# EAGLE design MODUL_RS232_V101 (EAGLE 6.4)

## Sheet 1 of 2
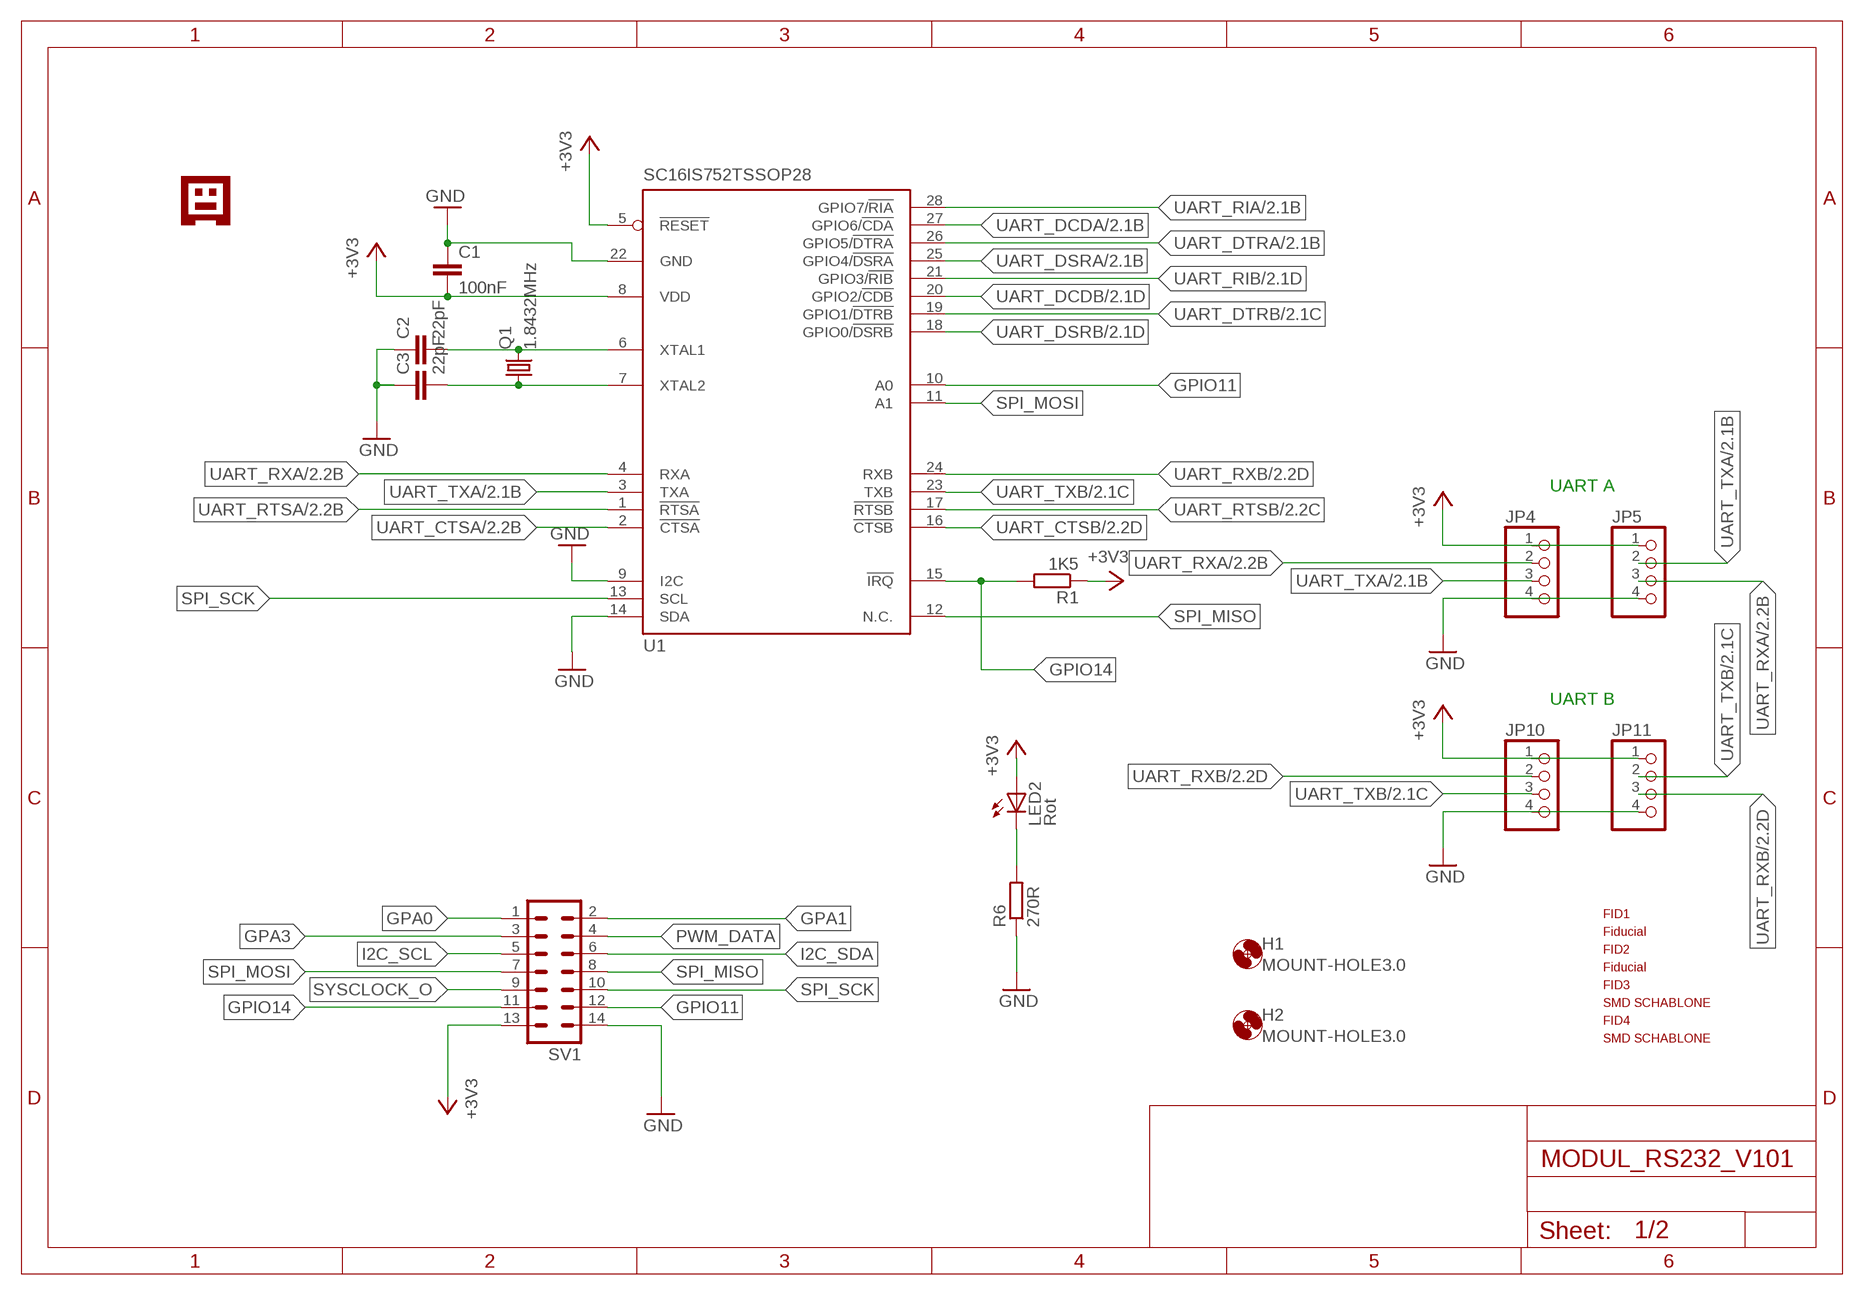
[diagram p0: schematic, sheet 1]

### Parts
C1  100nF  C-EUC0805  [C0805]
C2  22pF  C-EUC0805  [C0805]
C3  22pF  C-EUC0805  [C0805]
FID1  PASSERMARKEN_FIDUCIAL  [PASSERMARKEN_FIDUCIAL]
FID2  PASSERMARKEN_FIDUCIAL  [PASSERMARKEN_FIDUCIAL]
FID3  PASSERMARKEN_FIDUCIAL  [PASSERMARKEN_FIDUCIAL]
FID4  PASSERMARKEN_FIDUCIAL  [PASSERMARKEN_FIDUCIAL]
H1  MOUNT-HOLE3.0  [3,0]
H2  MOUNT-HOLE3.0  [3,0]
JP4  PINHD-1X4  [1X04]
JP5  PINHD-1X4  [1X04]
JP10  PINHD-1X4  [1X04]
JP11  PINHD-1X4  [1X04]
LED2  Rot  LEDCHIP-LED0805  [CHIP-LED0805]
Q1  1.8432MHz  CRYSTALHC49UP  [HC49UP]
R1  1K5  R-EU_R0805  [R0805]
R6  270R  R-EU_R0805  [R0805]
SV1  ML14  [ML14]
U1  SC16IS752TSSOP28  [TSSOP28]
U$2  GNUBLINLOGOSIEB  [GNUSIEBDRUCK]

### Nets
+3V3: C1.2 JP4.1 JP5.1 JP10.1 JP11.1 LED2.A R1.1 SV1.13 U1.5(!RESET) U1.8(VDD) ; also sheet 2
GND: C1.1 C2.1 C3.1 JP4.4 JP5.4 JP10.4 JP11.4 R6.1 SV1.14 U1.9(I2C) U1.14(SDA) U1.22(GND) ; also sheet 2
GPA0: SV1.1
GPA1: SV1.2
GPA3: SV1.3
GPIO11: SV1.12 U1.10(A0)
GPIO14: R1.2 SV1.11 U1.15(!IRQ)
I2C_SCL: SV1.5
I2C_SDA: SV1.6
N$3: C2.2 Q1.2 U1.6(XTAL1)
N$4: C3.2 Q1.1 U1.7(XTAL2)
N$9: LED2.C R6.2
PWM_DATA: SV1.4
SPI_MISO: SV1.8 U1.12(N.C.)
SPI_MOSI: SV1.7 U1.11(A1)
SPI_SCK: SV1.10 U1.13(SCL)
SYSCLOCK_O: SV1.9
UART_CTSA: U1.2(!CTSA) ; also sheet 2
UART_CTSB: U1.16(!CTSB) ; also sheet 2
UART_DCDA: U1.27(GPIO6/!CDA) ; also sheet 2
UART_DCDB: U1.20(GPIO2/!CDB) ; also sheet 2
UART_DSRA: U1.25(GPIO4/!DSRA) ; also sheet 2
UART_DSRB: U1.18(GPIO0/!DSRB) ; also sheet 2
UART_DTRA: U1.26(GPIO5/!DTRA) ; also sheet 2
UART_DTRB: U1.19(GPIO1/!DTRB) ; also sheet 2
UART_RIA: U1.28(GPIO7/!RIA) ; also sheet 2
UART_RIB: U1.21(GPIO3/!RIB) ; also sheet 2
UART_RTSA: U1.1(!RTSA) ; also sheet 2
UART_RTSB: U1.17(!RTSB) ; also sheet 2
UART_RXA: JP4.2 JP5.3 U1.4(RXA) ; also sheet 2
UART_RXB: JP10.2 JP11.3 U1.24(RXB) ; also sheet 2
UART_TXA: JP4.3 JP5.2 U1.3(TXA) ; also sheet 2
UART_TXB: JP10.3 JP11.2 U1.23(TXB) ; also sheet 2

### Notes on the sheet
- UART A
- UART B

## Sheet 2 of 2
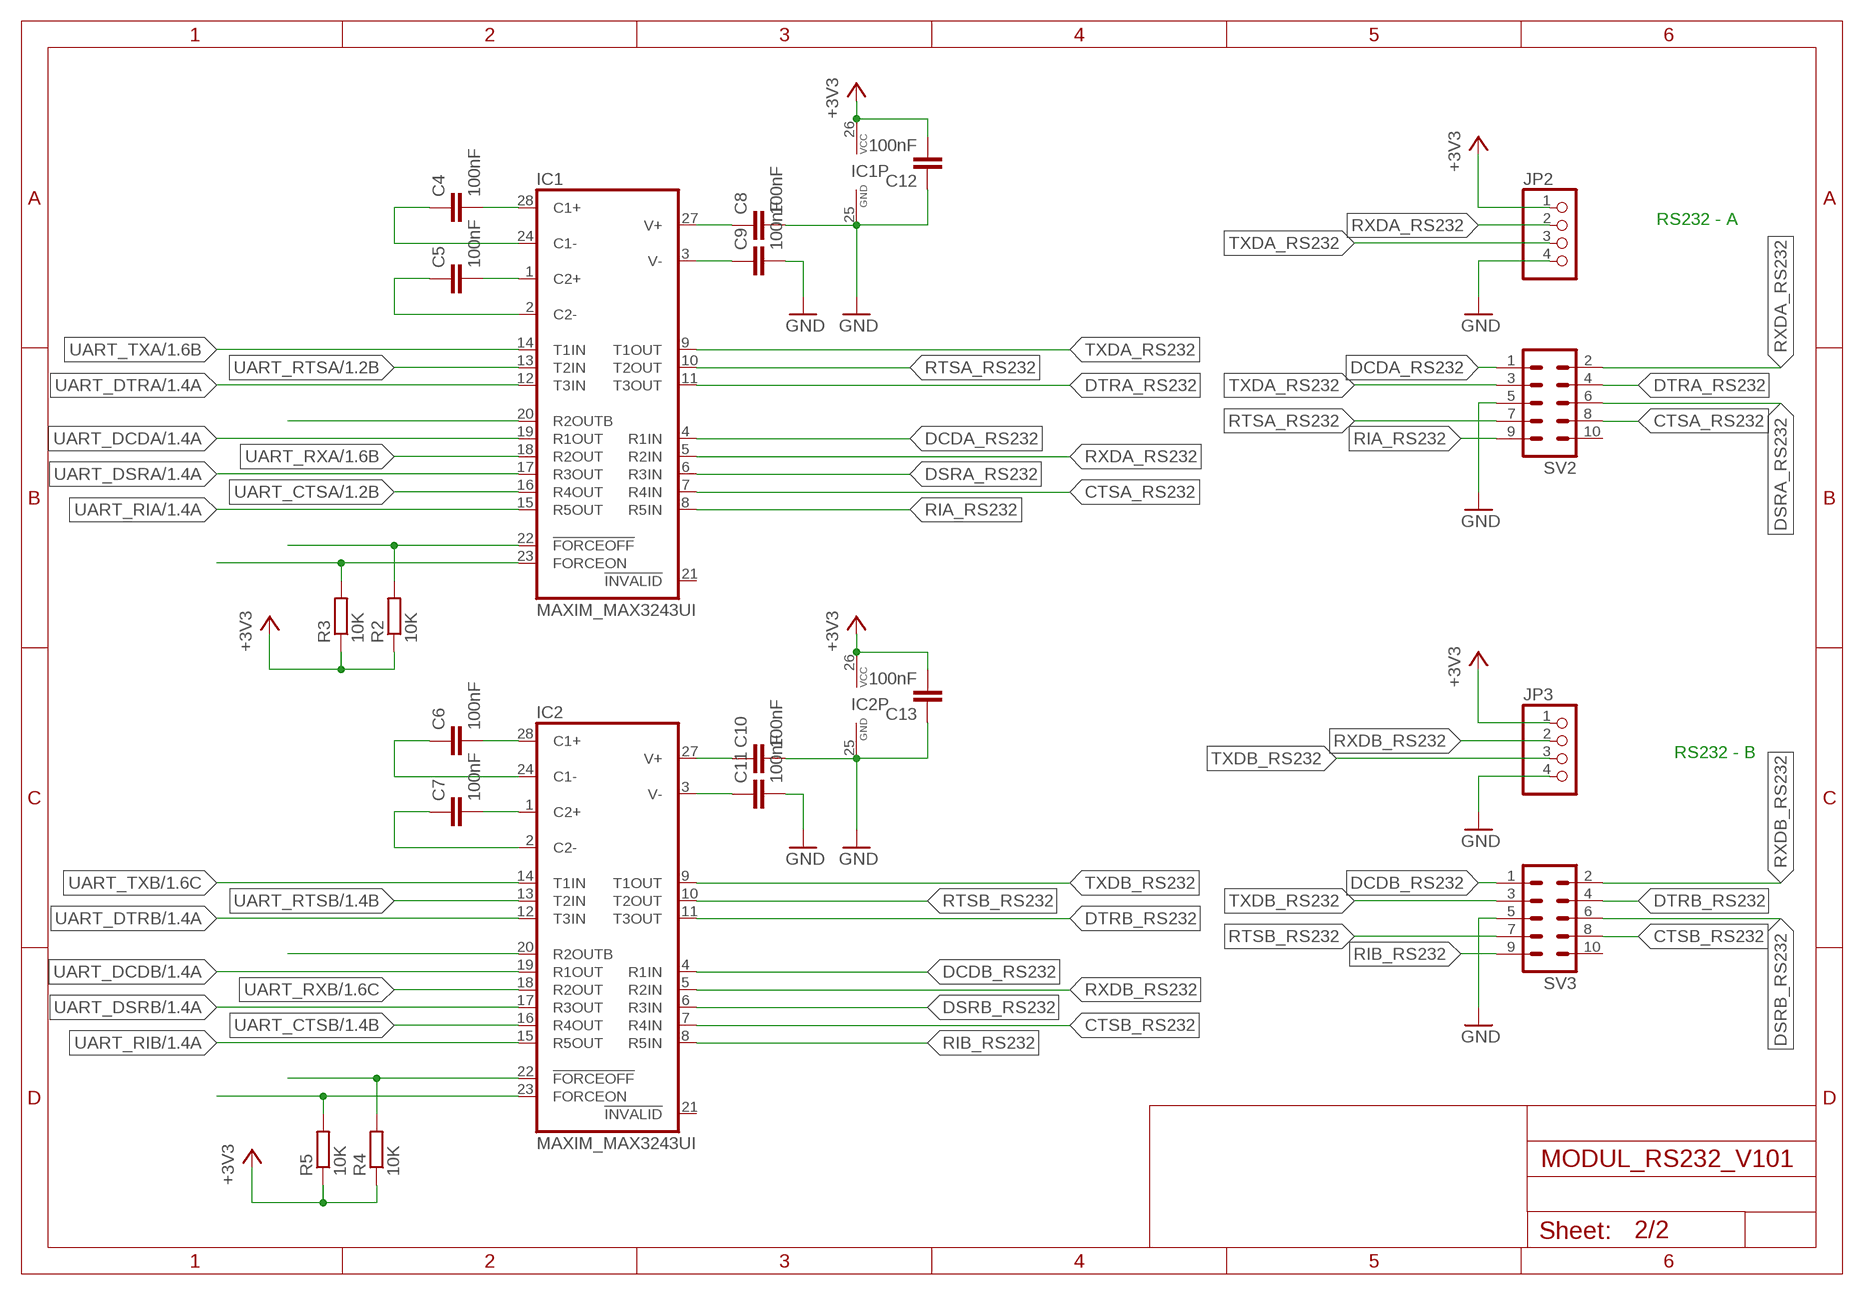
[diagram p1: schematic, sheet 2]

### Parts
C4  100nF  C-EUC0805  [C0805]
C5  100nF  C-EUC0805  [C0805]
C6  100nF  C-EUC0805  [C0805]
C7  100nF  C-EUC0805  [C0805]
C8  100nF  C-EUC0805  [C0805]
C9  100nF  C-EUC0805  [C0805]
C10  100nF  C-EUC0805  [C0805]
C11  100nF  C-EUC0805  [C0805]
C12  100nF  C-EUC0805  [C0805]
C13  100nF  C-EUC0805  [C0805]
IC1  MAXIM_MAX3243UI  [MAXIM_TSSOP28]
IC2  MAXIM_MAX3243UI  [MAXIM_TSSOP28]
JP2  PINHD-1X4  [1X04]
JP3  PINHD-1X4  [1X04]
R2  10K  R-EU_R0805  [R0805]
R3  10K  R-EU_R0805  [R0805]
R4  10K  R-EU_R0805  [R0805]
R5  10K  R-EU_R0805  [R0805]
SV2  ML10  [ML10]
SV3  ML10  [ML10]

### Nets
+3V3: C12.2 C13.2 IC1.26(VCC) IC2.26(VCC) JP2.1 JP3.1 R2.1 R3.1 R4.1 R5.1 ; also sheet 1
CTSA_RS232: IC1.7(R4IN) SV2.8
CTSB_RS232: IC2.7(R4IN) SV3.8
DCDA_RS232: IC1.4(R1IN) SV2.1
DCDB_RS232: IC2.4(R1IN) SV3.1
DSRA_RS232: IC1.6(R3IN) SV2.6
DSRB_RS232: IC2.6(R3IN) SV3.6
DTRA_RS232: IC1.11(T3OUT) SV2.4
DTRB_RS232: IC2.11(T3OUT) SV3.4
GND: C8.2 C9.2 C10.2 C11.2 C12.1 C13.1 IC1.25(GND) IC2.25(GND) JP2.4 JP3.4 SV2.5 SV3.5 ; also sheet 1
N$15: C4.2 IC1.28(C1+)
N$28: C5.2 IC1.1(C2+)
N$31: C4.1 IC1.24(C1-)
N$32: C5.1 IC1.2(C2-)
N$33: C6.2 IC2.28(C1+)
N$34: C7.2 IC2.1(C2+)
N$35: C6.1 IC2.24(C1-)
N$36: C7.1 IC2.2(C2-)
N$37: C8.1 IC1.27(V+)
N$38: C9.1 IC1.3(V-)
N$39: C10.1 IC2.27(V+)
N$40: C11.1 IC2.3(V-)
N$44: IC1.20(R2OUTB)
N$50: IC1.22(!FORCEOFF) R2.2
N$51: IC1.23(FORCEON) R3.2
N$63: IC2.20(R2OUTB)
N$69: IC2.22(!FORCEOFF) R4.2
N$70: IC2.23(FORCEON) R5.2
RIA_RS232: IC1.8(R5IN) SV2.9
RIB_RS232: IC2.8(R5IN) SV3.9
RTSA_RS232: IC1.10(T2OUT) SV2.7
RTSB_RS232: IC2.10(T2OUT) SV3.7
RXDA_RS232: IC1.5(R2IN) JP2.2 SV2.2
RXDB_RS232: IC2.5(R2IN) JP3.2 SV3.2
TXDA_RS232: IC1.9(T1OUT) JP2.3 SV2.3
TXDB_RS232: IC2.9(T1OUT) JP3.3 SV3.3
UART_CTSA: IC1.16(R4OUT) ; also sheet 1
UART_CTSB: IC2.16(R4OUT) ; also sheet 1
UART_DCDA: IC1.19(R1OUT) ; also sheet 1
UART_DCDB: IC2.19(R1OUT) ; also sheet 1
UART_DSRA: IC1.17(R3OUT) ; also sheet 1
UART_DSRB: IC2.17(R3OUT) ; also sheet 1
UART_DTRA: IC1.12(T3IN) ; also sheet 1
UART_DTRB: IC2.12(T3IN) ; also sheet 1
UART_RIA: IC1.15(R5OUT) ; also sheet 1
UART_RIB: IC2.15(R5OUT) ; also sheet 1
UART_RTSA: IC1.13(T2IN) ; also sheet 1
UART_RTSB: IC2.13(T2IN) ; also sheet 1
UART_RXA: IC1.18(R2OUT) ; also sheet 1
UART_RXB: IC2.18(R2OUT) ; also sheet 1
UART_TXA: IC1.14(T1IN) ; also sheet 1
UART_TXB: IC2.14(T1IN) ; also sheet 1
Unconnected: IC1.21(!INVALID) IC2.21(!INVALID) SV2.10 SV3.10

### Notes on the sheet
- RS232 - A
- RS232 - B

## Library data of the parts
C1-C13 = rcl:C-EU: CAPACITOR, European symbol
FID1 FID2 = KUBUS3:PASSERMARKEN_FIDUCIAL: SMD Passermarke
FID3 FID4 = SMDSCHABLONE:PASSERMARKEN_FIDUCIAL: SMD Passermarke
H1 H2 = holes:MOUNT-HOLE: MOUNTING HOLE with drill center marker
IC1 IC2 = usbprog:MAXIM_MAX3243*: RS-232 Transceivers with AutoShutdown 1µA Supply-Current, True +3V to +5.5V http://dbserv.maxim-ic.com/; OC_FARNELL: unknown; OC_NEWARK: unknown
JP2-JP5 JP10 JP11 = pinhead:PINHD-1X4: PIN HEADER
LED2 = led:LED: LED OSRAM: - CHIPLED LG R971, LG N971, LY N971, LG Q971, LY Q971, LO R971, LY R971 LH N974, LH R974 LS Q976, LO Q976, LY Q976 LO Q996 - Hyper CHIPLED LW Q18S LB Q993, LB Q99A, LB R99A - SideLED LS A670, LO A670, LY A670, LG A670, LP A670 LB A673, LV A673, LT A673, LW A673 LH A674 LY A675 LS A676, LA A676, LO A676, LY A676, LW A676 LS A679, LY A679, LG A679 - Hyper Micro SIDELED® LS Y876, LA Y876, LO Y876, LY Y876 LT Y87S - SmartLED LW L88C, LW L88S LB L89C, LB L89S, LG L890 LS L89K, LO L89K, LY L89K LS L896, LA L896, LO L896, LY L896 - TOPLED LS T670, LO T670, LY T670, LG T670, LP T670 LSG T670, LSP T670, LSY T670, LOP T670, LYG T670 LG T671, LOG T671, LSG T671 LB T673, LV T673, LT T673, LW T673 LH T674 LS T676, LA T676, LO T676, LY T676, LB T676, LH T676, LSB T676, LW T676 LB T67C, LV T67C, LT T67C, LS T67K, LO T67K, LY T67K, LW E67C LS E67B, LA E67B, LO E67B, LY E67B, LB E67C, LV E67C, LT E67C LW T67C LS T679, LY T679, LG T679 LS T770, LO T770, LY T770, LG T770, LP T770 LB T773, LV T773, LT T773, LW T773 LH T774 LS E675, LA E675, LY E675, LS T675 LS T776, LA T776, LO T776, LY T776, LB T776 LHGB T686 LT T68C, LB T68C - Hyper Mini TOPLED® LB M676 - Mini TOPLED Santana® LG M470 LS M47K, LO M47K, LY M47K Source: http://www.osram.convergy.de LUXEON: - LUMILED® LXK2-PW12-R00, LXK2-PW12-S00, LXK2-PW14-U00, LXK2-PW14-V00 LXK2-PM12-R00, LXK2-PM12-S00, LXK2-PM14-U00 LXK2-PE12-Q00, LXK2-PE12-R00, LXK2-PE12-S00, LXK2-PE14-T00, LXK2-PE14-U00 LXK2-PB12-K00, LXK2-PB12-L00, LXK2-PB12-M00, LXK2-PB14-N00, LXK2-PB14-P00, LXK2-PB14-Q00 LXK2-PR12-L00, LXK2-PR12-M00, LXK2-PR14-Q00, LXK2-PR14-R00 LXK2-PD12-Q00, LXK2-PD12-R00, LXK2-PD12-S00 LXK2-PH12-R00, LXK2-PH12-S00 LXK2-PL12-P00, LXK2-PL12-Q00, LXK2-PL12-R00 Source: www.luxeon.com KINGBRIGHT: KA-3528ASYC Source: www.kingbright.com
Q1 = crystal:CRYSTAL: CRYSTAL; OC_FARNELL: unknown; OC_NEWARK: unknown
R1-R6 = rcl:R-EU_: RESISTOR, European symbol
SV1 = con-ml:ML14: HARTING; OC_FARNELL: unknown; OC_NEWARK: unknown
SV2 SV3 = con-ml:ML10: HARTING; OC_FARNELL: unknown; OC_NEWARK: unknown
U1 = SC16IS752:SC16IS752: Dual UART with I²C-bus/SPI-Interface; FARNELL: 2101309
U$2 = EmbeddedProjectsLogos2:GNUBLINLOGO

## Board
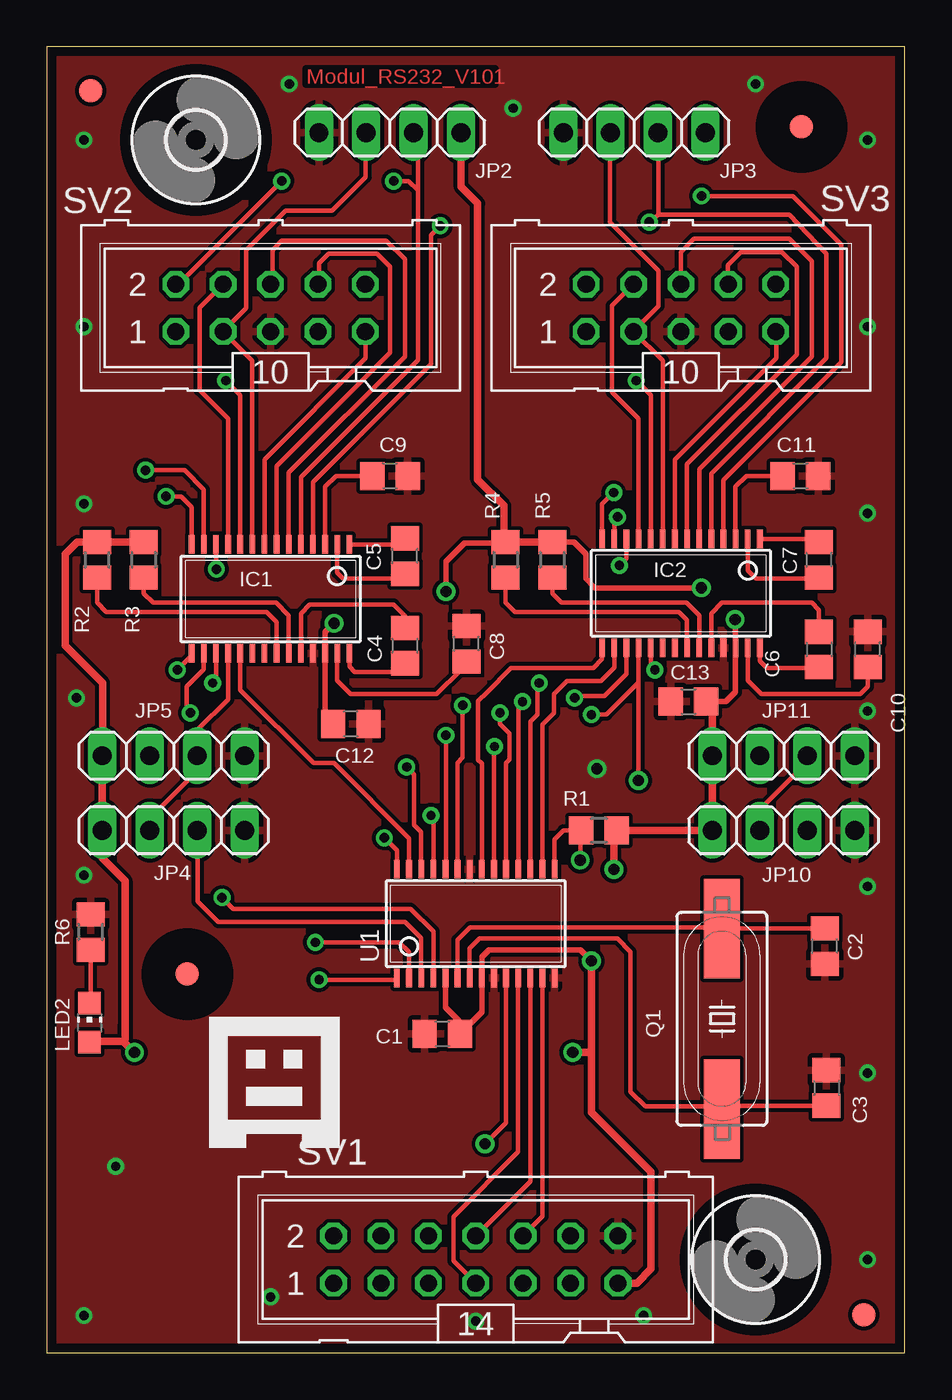
[diagram p2: board, top side]
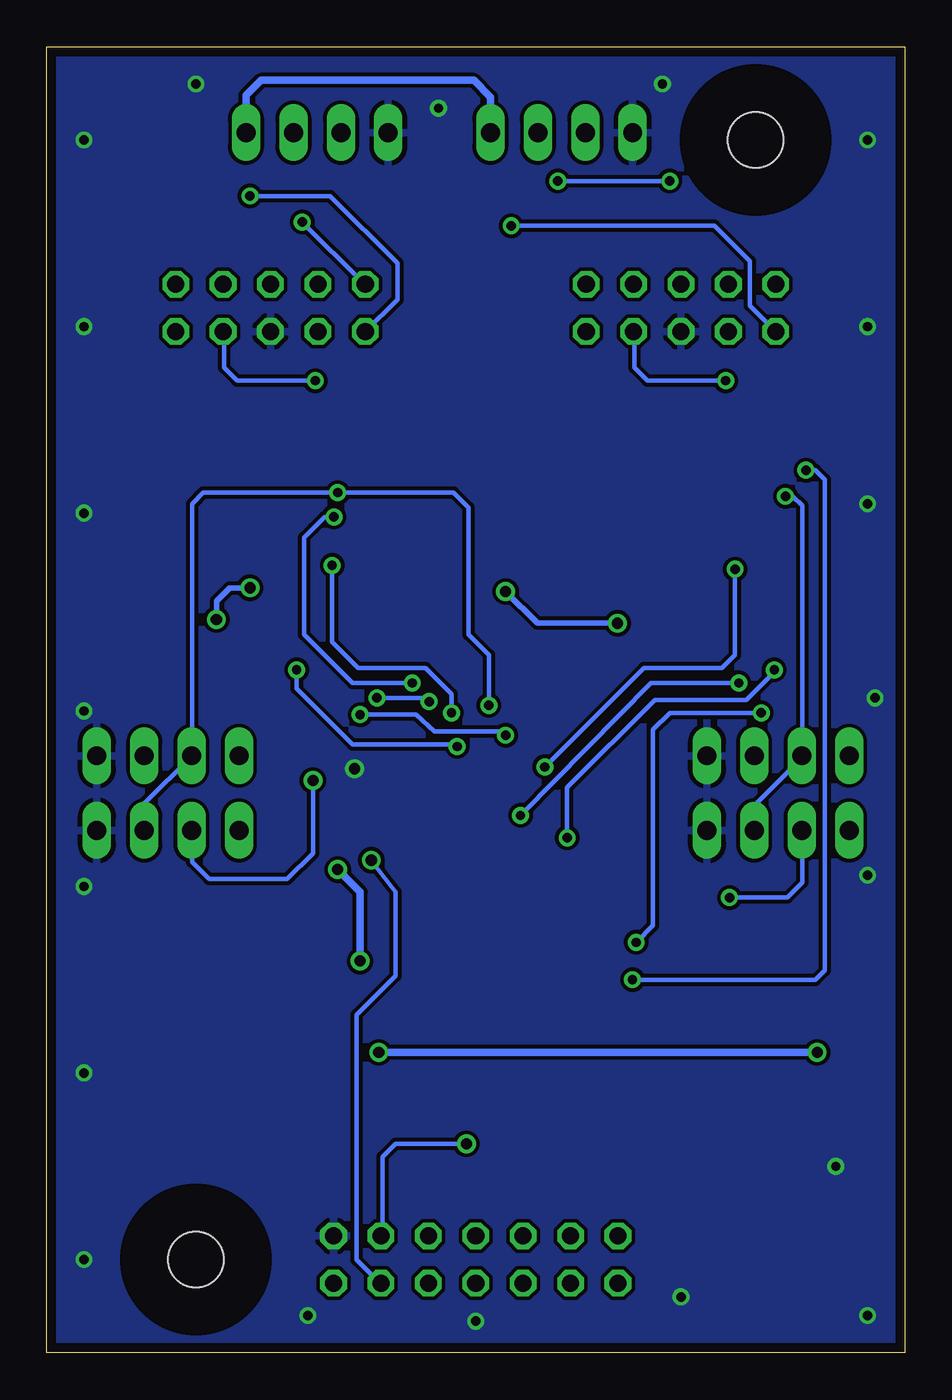
[diagram p3: board, bottom side, seen from below]

Size 46 x 70 mm. Coordinates in mm from the lower left corner, seen from the top.
Outline: 0,0 46,0 46,70 0,70 0,0
Copper layers (1*16): Top 0.035mm / dielectric 1.5mm / Bottom 0.035mm
Design rules "default": minimum track width 10mil, minimum drill 24mil, track to track 8mil, track to pad 8mil, pad to pad 8mil, via to via 8mil, smd to smd 8mil, copper to edge 20mil, drill to drill 8mil, minimum pad ring 10mil, minimum via ring 8mil, stop-mask expansion 2mil, vias tented up to drill 40mil, thermal gap 10mil

### Footprints (pad centres in the part's own frame; a part is rotated, then mirrored left to right if it is on the bottom)
C0805 = smd 1.3 x 1.5: 1 -0.95,0; 2 0.95,0
PASSERMARKEN_FIDUCIAL = smd 1.27 x 1.27: 1 0,0
3,0 = hole 3: 0,0
MAXIM_TSSOP28 = smd 0.305 x 0.991: 1 -4.225,-2.918; 2 -3.575,-2.918; 3 -2.925,-2.918; 4 -2.275,-2.918; 5 -1.625,-2.918; 6 -0.975,-2.918; 7 -0.325,-2.918; 8 0.325,-2.918; 9 0.975,-2.918; 10 1.625,-2.918; 11 2.275,-2.918; 12 2.925,-2.918; 13 3.575,-2.918; 14 4.225,-2.918; 15 4.225,2.918; 16 3.575,2.918; 17 2.925,2.918; 18 2.275,2.918; 19 1.625,2.918; 20 0.975,2.918; 21 0.325,2.918; 22 -0.325,2.918; 23 -0.975,2.918; 24 -1.625,2.918; 25 -2.275,2.918; 26 -2.925,2.918; 27 -3.575,2.918; 28 -4.225,2.918
1X04 = drill 1.016 long: 1 -3.81,0; 2 -1.27,0; 3 1.27,0; 4 3.81,0
CHIP-LED0805 = smd 1.2 x 1.2: A 0,-1.05; C 0,1.05
HC49UP = smd 5.334 x 1.93: 1 -4.826,0; 2 4.826,0
R0805 = smd 1.3 x 1.5: 1 -0.95,0; 2 0.95,0
ML14 = drill 0.914 octagon: 1 -7.62,-1.27; 2 -7.62,1.27; 3 -5.08,-1.27; 4 -5.08,1.27; 5 -2.54,-1.27; 6 -2.54,1.27; 7 0,-1.27; 8 0,1.27; 9 2.54,-1.27; 10 2.54,1.27; 11 5.08,-1.27; 12 5.08,1.27; 13 7.62,-1.27; 14 7.62,1.27
ML10 = drill 0.914 octagon: 1 -5.08,-1.27; 2 -5.08,1.27; 3 -2.54,-1.27; 4 -2.54,1.27; 5 0,-1.27; 6 0,1.27; 7 2.54,-1.27; 8 2.54,1.27; 9 5.08,-1.27; 10 5.08,1.27
TSSOP28 = smd 0.305 x 0.991: 1 -4.225,-2.918; 2 -3.575,-2.918; 3 -2.925,-2.918; 4 -2.275,-2.918; 5 -1.625,-2.918; 6 -0.975,-2.918; 7 -0.325,-2.918; 8 0.325,-2.918; 9 0.975,-2.918; 10 1.625,-2.918; 11 2.275,-2.918; 12 2.925,-2.918; 13 3.575,-2.918; 14 4.225,-2.918; 15 4.225,2.918; 16 3.575,2.918; 17 2.925,2.918; 18 2.275,2.918; 19 1.625,2.918; 20 0.975,2.918; 21 0.325,2.918; 22 -0.325,2.918; 23 -0.975,2.918; 24 -1.625,2.918; 25 -2.275,2.918; 26 -2.925,2.918; 27 -3.575,2.918; 28 -4.225,2.918

### Placement (x,y rotation side)
C1  21.2,17.1 0 top
C2  41.7,21.8 90 top
C3  41.8,14.2 270 top
C4  19.2,37.9 270 top
C5  19.2,42.7 90 top
C6  41.4,37.7 270 top
C7  41.4,42.5 90 top
C8  22.5,38 90 top
C9  18.4,47 0 top
C10  44,37.7 90 top
C11  40.4,47 0 top
C12  16.3,33.7 180 top
C13  34.4,34.9 0 top
FID1  7.54,20.3 0 top
FID2  40.46,65.7 0 top
FID3  2.35,67.63 0 top
FID4  43.81,2.03 0 top
H1  38,5 0 top
H2  8,65 0 top
IC1  12,40.4 180 top
IC2  34,40.7 180 top
JP2  18.4,65.4 180 top
JP3  31.5,65.4 180 top
JP4  6.8,28 0 top
JP5  6.8,32 0 top
JP10  39.5,28 0 top
JP11  39.5,32 0 top
LED2  2.3,17.7 0 top
Q1  36.2,17.9 90 top
R1  29.6,28 180 top
R2  2.7,42.5 270 top
R3  5.2,42.5 270 top
R4  24.6,42.5 270 top
R5  27.1,42.5 270 top
R6  2.35,22.55 270 top
SV1  23,5 0 top
SV2  12,56 0 top
SV3  34,56 0 top
U1  23,23 0 top
U$2  8.7,11 0 top

### Tracks (layer width: path | path; a pad name or v marks a point on that pad's centre or on a via)
+3V3  (via drill 0.6)
  Top 0.254: 14.93,34.12 C12.2 | 22.1,17.8 22.1,17.15 C1.2
  Top 0.305: 14.93,34.12 IC1.26 14.93,38.62 v15.4,39.1 | C13.2 36.4,34.9 36.92,35.42 IC2.26 36.92,39.27 v36.9,39.3 | v21.4,40.8 21.4,42.4 22.4,43.4 24.55,43.4 R4.1 | R5.1 28.25,43.45 28.9,42.8 28.9,41.5 29.4,41 v35.1,41 | v29.2,21 28.6,21.6 23.7,21.6 23.32,21.23 U1.8 23.32,18.27 C1.2 | U1.5 21.38,18.52 22.1,17.8
  Top 0.406: R3.1 R2.1 1.65,43.45 1,42.8 1,37.9 3,35.9 JP5.1 JP4.1 2.99,26.51 4.2,25.3 4.2,17.5 4.2,16.8 4.1,16.7 | R5.1 R4.1 24.5,43.55 24.5,45.4 23.1,46.8 23.1,61.6 22.21,62.49 JP2.1 | C13.2 35.69,34.56 JP11.1 JP10.1 34.89,28 R1.1 30.4,27.85 v30.4,25.9 | SV1.13 31.63,3.73 32.4,4.5 32.4,9.7 29.2,12.9 29.2,16.2 | 29.2,16.2 v29.2,21 | LED2.A 2.35,16.7 4.1,16.7 | 4.1,16.7 v4.7,16.1 | v28.2,16.1 29.1,16.1 29.2,16.2
  Bottom 0.305: v15.4,39.1 19.7,39.1 v21.4,40.8 | v35.1,41 36.2,41 36.9,40.3 v36.9,39.3
  Bottom 0.406: v29.2,21 29.2,24.7 29.3,24.8 v30.4,25.9 | JP10.1 | JP3.1 35.31,67.39 34.5,68.2 23.1,68.2 22.2,67.3 JP2.1 | v4.7,16.1 v28.2,16.1
CTSA_RS232
  Top 0.254: IC1.7 12.32,47.52 18.4,53.6 18.4,58.2 17.7,58.9 15.1,58.9 14.6,58.4 14.6,57.33 SV2.8
CTSB_RS232
  Top 0.254: IC2.7 34.33,47.62 40.2,53.5 40.2,58.2 39.4,59 37.2,59 36.5,58.3 36.5,57.31 SV3.8
DCDA_RS232  (via drill 0.5)
  Top 0.254: IC1.4 14.28,46.67 20.6,53 20.6,59.8 20.6,59.9 v21.1,60.4
  Bottom 0.254: v21.1,60.4 10.2,60.4 8.3,58.5 8.3,56.11 SV2.1
DCDB_RS232  (via drill 0.5)
  Top 0.254: IC2.4 36.27,46.77 42.6,53.1 42.6,59.4 40,62 v35.1,62
  Bottom 0.254: v35.1,62 30.8,62 27.2,58.4 27.2,56.45 SV3.1
DSRA_RS232
  Top 0.254: IC1.6 12.97,47.17 19.2,53.4 19.2,58.6 18.2,59.6 12.6,59.6 12.1,59.1 12.1,57.37 SV2.6
DSRB_RS232
  Top 0.254: IC2.6 34.98,47.38 41,53.4 41,58.5 39.8,59.7 34.7,59.7 34,59 SV3.6
DTRA_RS232
  Top 0.254: IC1.11 9.72,50.08 8.2,51.6 8.2,56.01 SV2.4
DTRB_RS232
  Top 0.254: IC2.11 31.73,50.08 30.3,51.5 30.3,56.11 SV3.4
GND  (via drill 0.5, 0.6)
  other vias: 29.5,31.3 2,2 23,1.7 12,3 32,2 44,5 44,15 44,25 44,34.4 44,45 44,55 44,65 38,68 25,66.7 13,68 3.7,10 2,25.6 1.6,35.1 2,45.5 2,55 2,65
  pour Bottom: -1.9,71.3 48.1,72.3 47.5,-1.9 -2.3,-2.4
  pour Top: -1.5,71.4 47.9,71.8 47.5,-1.6 -1.9,-2
GPIO11  (via drill 0.6)
  Top 0.254: U1.10 24.62,12.32 v23.5,11.2
  Bottom 0.254: v23.5,11.2 27.3,11.2 28,10.5 28,6.35 SV1.12
GPIO14  (via drill 0.6)
  Top 0.254: U1.15 27.23,27.52 27.7,28 R1.2 28.6,27.95 v28.6,26.4
  Bottom 0.254: SV1.11 28.13,3.73 29.4,5 29.4,18.1 27.3,20.2 27.3,24.7 v28.6,26.4
N$3
  Top 0.254: C2.2 35.88,22.75 Q1.2 35.77,22.8 22.7,22.8 22.02,22.12 U1.6
N$4
  Top 0.254: 36.3,13.25 35.88,13.25 Q1.1 | 36.3,13.25 C3.2 | U1.7 22.68,21.68 23.2,22.2 30.6,22.2 31.3,21.5 31.3,14 32.1,13.2 36.05,13.2 36.3,13.25
N$9
  Top 0.254: R6.2 2.35,18.8 LED2.C
N$15
  Top 0.254: IC1.28 16.23,36.77 16.5,36.5 18.95,36.5 C4.2
N$28
  Top 0.254: IC1.1 19.27,43.32 C5.2
N$31
  Top 0.254: IC1.24 13.62,39.62 14.1,40.1 18.6,40.1 19.2,39.5 C4.1
N$32
  Top 0.254: IC1.2 15.57,41.83 15.9,41.5 19.35,41.5 C5.1
N$33
  Top 0.254: IC2.28 38.23,37.08 38.6,36.7 41.35,36.7 C6.2
N$34
  Top 0.254: IC2.1 41.23,43.62 C7.2
N$35
  Top 0.254: IC2.24 35.62,39.62 36.2,40.2 41,40.2 41.4,39.8 C6.1
N$36
  Top 0.254: IC2.2 37.58,41.92 38,41.5 41.35,41.5 C7.1
N$37
  Top 0.254: C8.1 22.2,36.6 20.9,35.3 16.3,35.3 15.6,36 15.57,36.02 IC1.27
N$38
  Top 0.254: IC1.3 14.93,46.42 15.5,47 C9.1
N$39
  Top 0.254: IC2.27 37.58,36.02 38.3,35.3 43.6,35.3 44,35.7 C10.1
N$40
  Top 0.254: IC2.3 36.92,46.42 37.5,47 C11.1
N$50
  Top 0.254: IC1.22 12.32,39.17 11.8,39.7 3.2,39.7 2.7,40.2 R2.2
N$51
  Top 0.254: IC1.23 12.97,39.52 12.3,40.2 5.7,40.2 5.2,40.7 R3.2
N$69
  Top 0.254: IC2.22 34.33,39.27 33.9,39.7 25.1,39.7 24.6,40.2 R4.2
N$70
  Top 0.254: IC2.23 34.98,39.52 34.3,40.2 27.6,40.2 27.1,40.7 R5.2
RIA_RS232
  Top 0.254: IC1.8 11.68,47.88 17.1,53.3 17.1,54.71 SV2.9
RIB_RS232
  Top 0.254: IC2.8 33.67,47.88 39.1,53.3 39.1,54.71 SV3.9
RTSA_RS232  (via drill 0.5)
  Top 0.254: IC1.10 10.38,51.33 v9.6,52.1
  Bottom 0.254: v9.6,52.1 13.8,52.1 14.5,52.8 14.5,54.69 SV2.7
RTSB_RS232  (via drill 0.5)
  Top 0.254: IC2.10 32.38,51.33 v31.6,52.1
  Bottom 0.254: v31.6,52.1 35.8,52.1 36.5,52.8 36.5,54.69 SV3.7
RXDA_RS232  (via drill 0.5)
  Top 0.254: IC1.5 13.62,46.92 19.9,53.2 19.9,62.3 | 19.9,62.3 19.9,65.17 JP2.2 | SV2.2 7.07,57.27 v12.6,62.8 | v18.6,62.8 19.4,62.8 19.9,62.3
  Bottom 0.254: v18.6,62.8 v12.6,62.8 | JP2.2 19.7,65.33
RXDB_RS232  (via drill 0.5)
  Top 0.254: IC2.5 35.62,47.12 41.8,53.3 41.8,58.9 39.8,61 32.8,61 | 32.8,61 32.8,65.33 JP3.2 | 32.8,61 v32.3,60.6
  Bottom 0.254: SV3.2 29.02,57.32 v32.3,60.6
SPI_MISO
  Top 0.254: U1.12 25.93,9.2 SV1.8
SPI_MOSI
  Top 0.254: U1.11 25.27,10.78 21.8,7.3 21.8,4.93 SV1.7
SPI_SCK
  Top 0.254: U1.13 26.57,7.3 SV1.10
TXDA_RS232
  Top 0.254: IC1.9 11.03,53.16 SV2.3 9.46,54.76 10.7,56 10.7,59.1 12.8,61.2 15.3,61.2 17.1,63 17.1,65.37 JP2.3
TXDB_RS232
  Top 0.254: IC2.9 33.02,53.16 SV3.3 31.46,54.76 32.8,56.1 32.8,58 30.2,60.6 30.2,65.37 JP3.3
UART_CTSA  (via drill 0.5)
  Top 0.254: IC1.16 8.43,36.62 7.5,35.7 7.5,34.5 v7.7,34.3 | v14.4,22 18.9,22 19.43,21.48 U1.2
  Bottom 0.254: v7.7,34.3 12.6,34.3 13.5,33.4 13.5,22.9 v14.4,22
UART_CTSB
  Top 0.254: IC2.16 30.43,36.73 29.7,36 27.9,36 27.2,35.3 27.2,34.3 27.1,34.2 26.57,33.67 U1.16
UART_DCDA
  Top 0.254: U1.27 19.43,27.57 15.4,31.6 14.3,31.6 10.4,35.5 10.38,35.52 IC1.19
UART_DCDB  (via drill 0.5)
  Top 0.254: IC2.19 32.38,36.83 v32.6,36.6 | U1.20 23.98,32.08 v24,32.5
  Bottom 0.254: v32.6,36.6 32.6,35.6 29.6,32.6 26.2,32.6 26.1,32.6 24.1,32.6 v24,32.5
UART_DSRA  (via drill 0.5)
  Top 0.254: IC1.17 9.07,36.02 v8.9,35.9 | U1.25 20.73,28.68 v20.6,28.8
  Bottom 0.254: v8.9,35.9 13.6,35.9 20.5,28.9 v20.6,28.8
UART_DSRB  (via drill 0.5)
  Top 0.254: IC2.17 31.07,36.38 29.9,35.2 28.4,35.2 v28.3,35.1 | v25.5,34.9 25.3,34.7 25.3,25.94 U1.18
  Bottom 0.254: v28.3,35.1 25.7,35.1 v25.5,34.9
UART_DTRA  (via drill 0.5)
  Top 0.254: IC1.12 9.07,42.02 v9.1,42 | 19.6,31.1 v19.3,31.4 19.7,31 19.7,28.3 20.07,27.93 U1.26
  Bottom 0.254: v9.1,42 9.1,37.4 9.8,36.7 14,36.7 v19.3,31.4
UART_DTRB  (via drill 0.5)
  Top 0.254: IC2.12 31.07,42.58 v30.7,42.2 | v24.3,34.3 24.3,33.7 24.7,33.3 24.8,33.2 24.8,31.8 24.62,31.62 U1.19
  Bottom 0.254: v30.7,42.2 30.7,38.1 29.3,36.7 25.7,36.7 24.6,35.6 24.3,35.3 v24.3,34.3
UART_RIA  (via drill 0.5)
  Top 0.254: IC1.15 7.78,37.38 v7,36.6 | U1.28 18.77,26.93 v18.1,27.6
  Bottom 0.254: v7,36.6 7,36.5 8.5,35 13.4,35 18.1,30.3 v18.1,27.6
UART_RIB
  Top 0.254: IC2.15 29.77,37.17 29.3,36.7 24.9,36.7 23.6,35.4 23.12,34.92 23.12,31.77 23.3,31.6 23.32,31.57 U1.21
UART_RTSA  (via drill 0.5)
  Top 0.254: IC1.13 8.43,46.27 7.4,47.3 v5.3,47.3 | v14.6,20 18.69,20 U1.1
  Bottom 0.254: v5.3,47.3 4.8,47.3 4.3,46.8 4.3,20.5 4.8,20 v14.6,20
UART_RTSB  (via drill 0.5)
  Top 0.254: U1.17 25.93,33.83 26.3,34.2 26.3,35.8 v26.4,35.9 | IC2.13 30.43,44.62 v30.6,44.8
  Bottom 0.254: v26.4,35.9 29.6,35.9 32.2,38.5 32.2,42.3 32.2,43.7 31.7,44.2 31.1,44.8 v30.6,44.8
UART_RXA  (via drill 0.5)
  Top 0.254: IC1.18 9.72,35.02 8.1,33.4 8.1,33.03 JP5.3 8.1,31.97 8.1,31.2 5.53,28.63 JP4.2 | U1.4 20.73,22.57 19.5,23.8 10,23.8 v9.4,24.4
  Bottom 0.254: v9.4,24.4 6.3,24.4 5.5,25.2 5.5,27.97 JP4.2
UART_RXB  (via drill 0.5, 0.6)
  Top 0.254: JP11.3 40.77,31.67 38.2,29.1 38.2,29.03 JP10.2 | 31.73,35.92 IC2.18 | 31.73,35.92 30,34.2 v29.2,34.2 | v21.4,33.1 21.4,25.94 U1.24 | 31.73,35.92 v31.73,30.68
  Bottom 0.254: v29.2,34.2 26.2,34.2 25.2,33.3 21.6,33.3 v21.4,33.1 | v31.73,30.68 31.73,26.77 33.1,25.4 37.3,25.4 38.2,26.3 38.2,27.97 JP10.2
UART_TXA  (via drill 0.5)
  Top 0.254: IC1.14 7.78,45.33 7.2,45.9 v6.4,45.9 | U1.3 20.07,22.23 19.2,23.1 9.2,23.1 8.1,24.2 8.1,27.97 JP4.3
  Bottom 0.254: v6.4,45.9 6,45.9 5.5,45.4 5.5,33.03 JP5.2 5.53,31.87 8.1,29.3 8.1,29.03 JP4.3
UART_TXB  (via drill 0.5)
  Top 0.254: IC2.14 29.77,45.48 v30.4,46.1 | U1.23 22.02,31.62 22.3,31.9 v22.3,34.7
  Bottom 0.254: JP10.3 40.77,29.43 38.2,32 38.2,32.97 JP11.2 38.2,33.03 38.2,45.5 37.6,46.1 v30.4,46.1 29.2,46.1 24.2,46.1 23.4,45.3 23.4,38.5 22.3,37.4 v22.3,34.7

### Text on the board
Top: Modul_RS232_V101
tDocu: www.gnublin.org | RS232 - A | RS232 - B | UART-A | UART-B
bDocu: GND | TXD | RXD | +3V3 | GND | TXD | RXD | +3V3 | +3V3 | +3V3 | GND | GND | GPA1 | PWM | SDA | MISO | SCK | IO11 | GND | GPA0 | GPA3 | SCL | MOSI | SCLK | IO14 | +3V3